# Altium schematic sheet S7CAS-PLEIADES-CARTE-MERE_P20_DDR3-decouplage.SchDoc
size Tabloid; Sheet_Name: DDR3 Decoupling; Size: 11x17
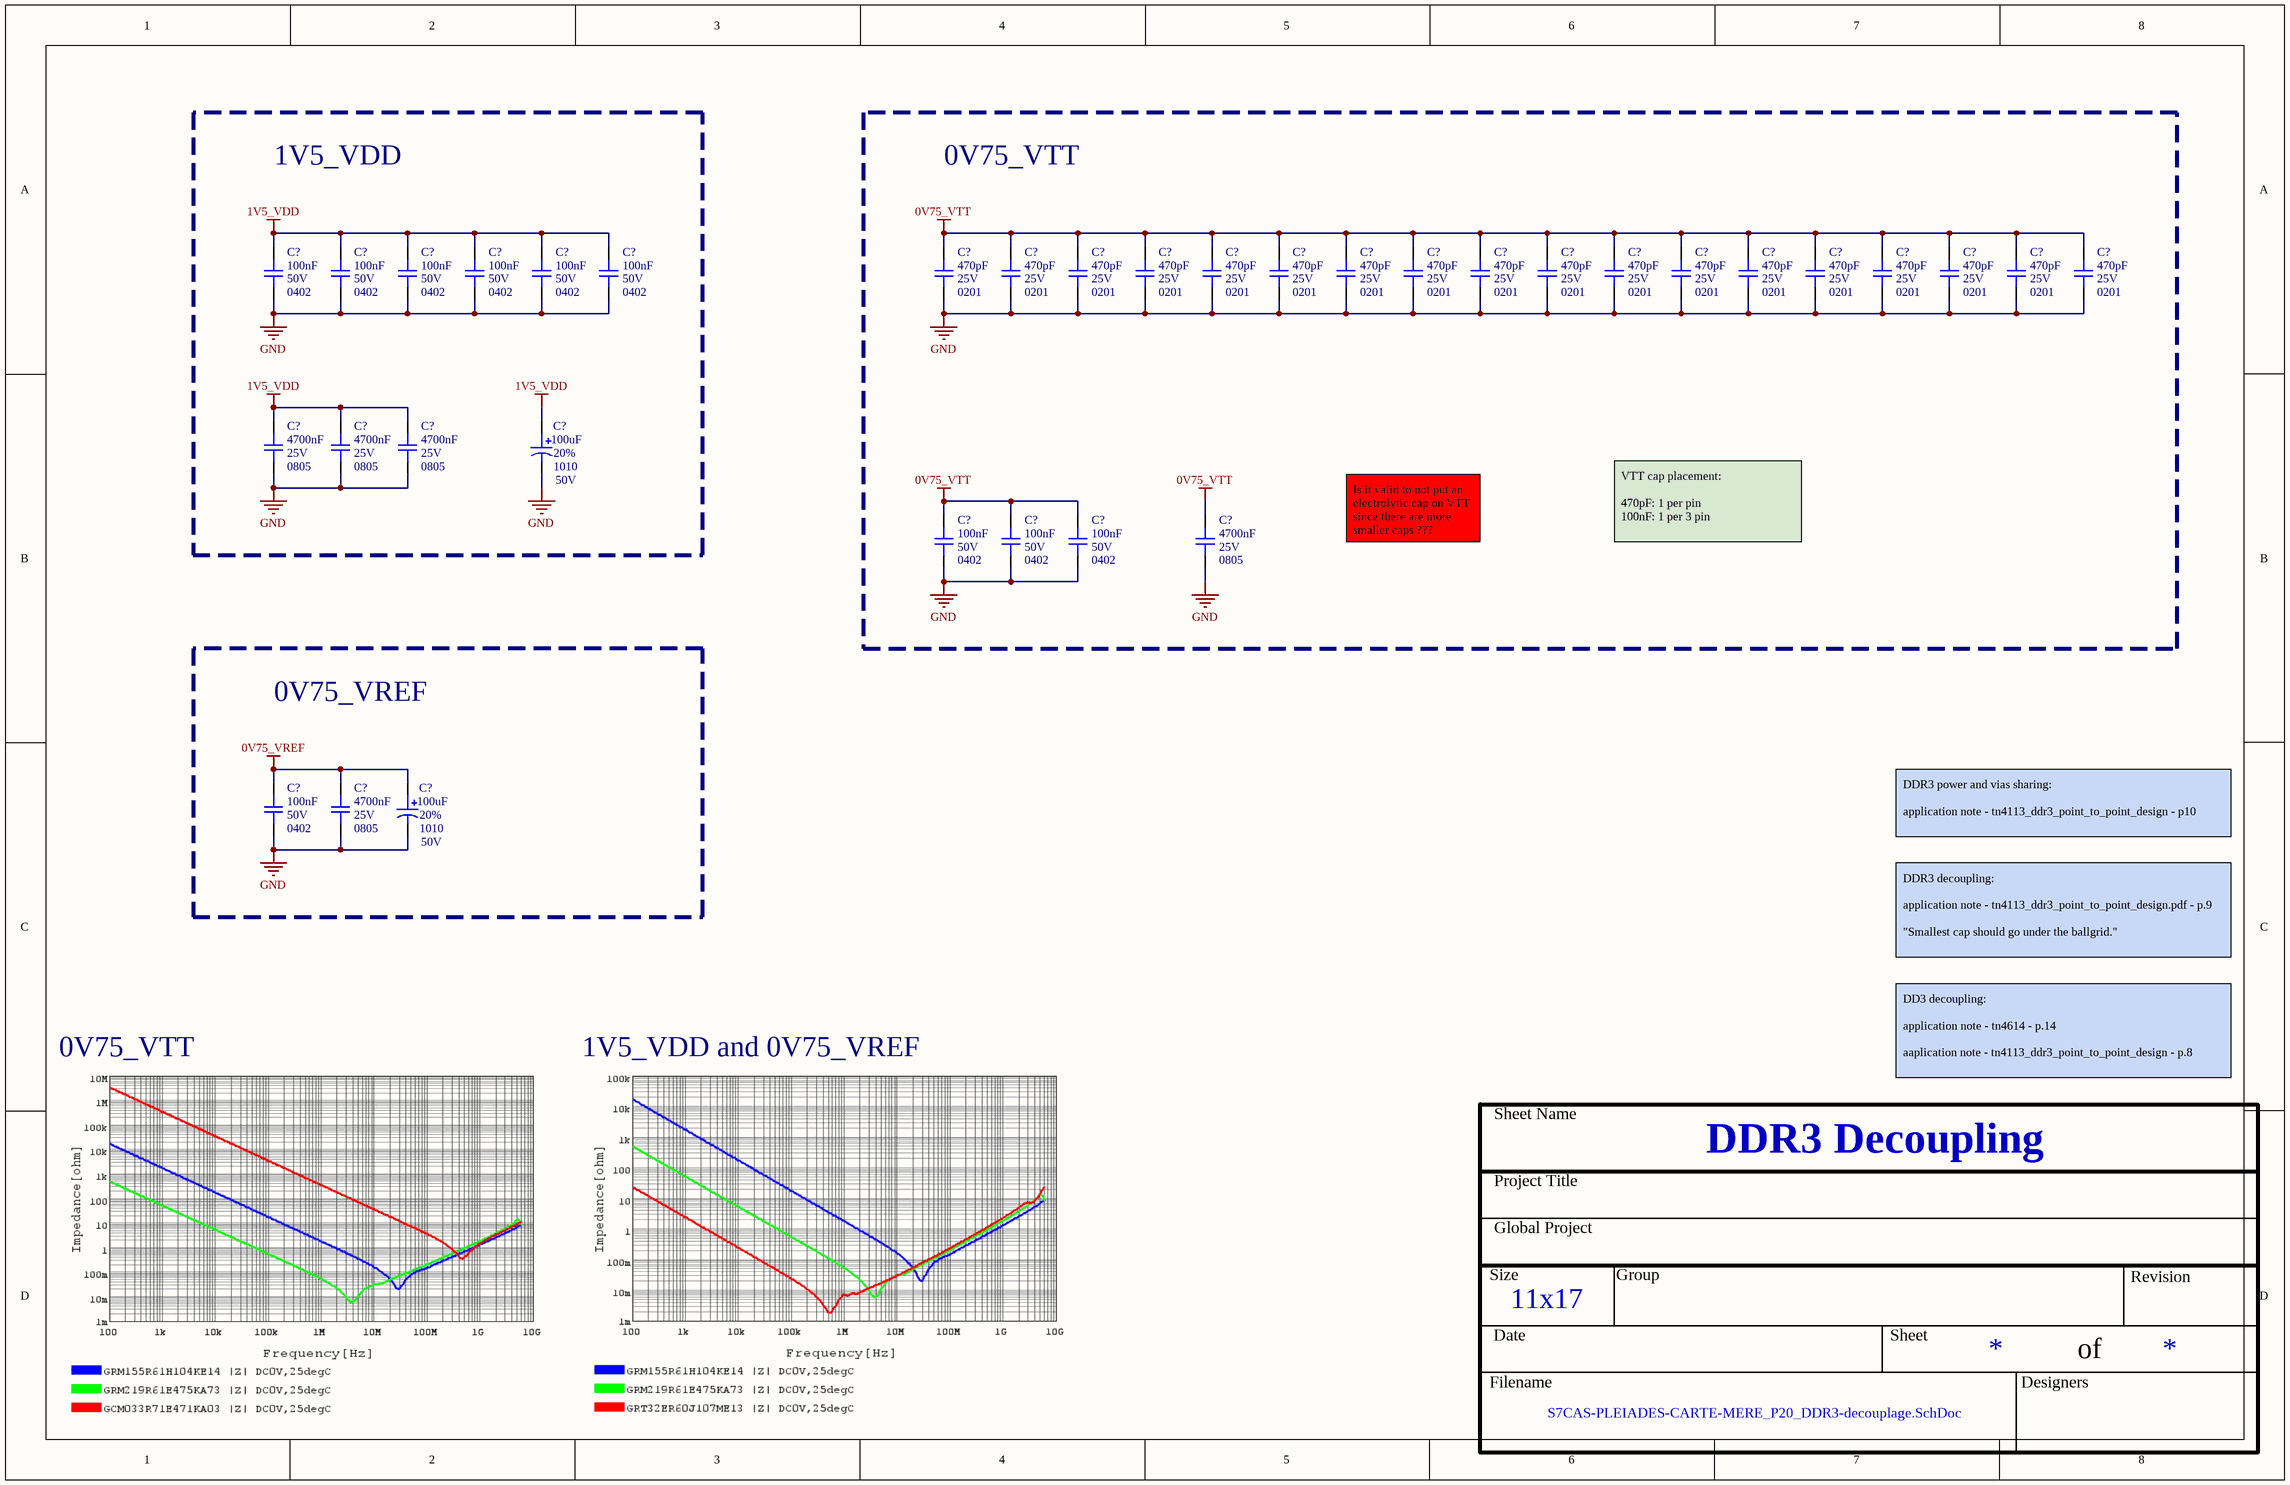
[diagram p0: S7CAS-PLEIADES-CARTE-MERE_P20_DDR3-decouplage.SchDoc]

## Parts
(Parts that share a designator on the sheet are numbered #1, #2 ... from top to bottom, then left to right.)
C?#1  value 100nF  Voltage: 50V  Package: 0402  [CAP_0201]  (hidden comment: CAP - 0201)
C?#2  value 100nF  Voltage: 50V  Package: 0402  [CAP_0201]  (hidden comment: CAP - 0201)
C?#3  value 100nF  Voltage: 50V  Package: 0402  [CAP_0201]  (hidden comment: CAP - 0201)
C?#4  value 100nF  Voltage: 50V  Package: 0402  [CAP_0201]  (hidden comment: CAP - 0201)
C?#5  value 100nF  Voltage: 50V  Package: 0402  [CAP_0201]  (hidden comment: CAP - 0201)
C?#6  value 100nF  Voltage: 50V  Package: 0402  [CAP_0201]  (hidden comment: CAP - 0201)
C?#7  value 470pF  Voltage: 25V  Package: 0201  [CAP_0201]  (hidden comment: CAP - 0201)
C?#8  value 470pF  Voltage: 25V  Package: 0201  [CAP_0201]  (hidden comment: CAP - 0201)
C?#9  value 470pF  Voltage: 25V  Package: 0201  [CAP_0201]  (hidden comment: CAP - 0201)
C?#10  value 470pF  Voltage: 25V  Package: 0201  [CAP_0201]  (hidden comment: CAP - 0201)
C?#11  value 470pF  Voltage: 25V  Package: 0201  [CAP_0201]  (hidden comment: CAP - 0201)
C?#12  value 470pF  Voltage: 25V  Package: 0201  [CAP_0201]  (hidden comment: CAP - 0201)
C?#13  value 470pF  Voltage: 25V  Package: 0201  [CAP_0201]  (hidden comment: CAP - 0201)
C?#14  value 470pF  Voltage: 25V  Package: 0201  [CAP_0201]  (hidden comment: CAP - 0201)
C?#15  value 470pF  Voltage: 25V  Package: 0201  [CAP_0201]  (hidden comment: CAP - 0201)
C?#16  value 470pF  Voltage: 25V  Package: 0201  [CAP_0201]  (hidden comment: CAP - 0201)
C?#17  value 470pF  Voltage: 25V  Package: 0201  [CAP_0201]  (hidden comment: CAP - 0201)
C?#18  value 470pF  Voltage: 25V  Package: 0201  [CAP_0201]  (hidden comment: CAP - 0201)
C?#19  value 470pF  Voltage: 25V  Package: 0201  [CAP_0201]  (hidden comment: CAP - 0201)
C?#20  value 470pF  Voltage: 25V  Package: 0201  [CAP_0201]  (hidden comment: CAP - 0201)
C?#21  value 470pF  Voltage: 25V  Package: 0201  [CAP_0201]  (hidden comment: CAP - 0201)
C?#22  value 470pF  Voltage: 25V  Package: 0201  [CAP_0201]  (hidden comment: CAP - 0201)
C?#23  value 470pF  Voltage: 25V  Package: 0201  [CAP_0201]  (hidden comment: CAP - 0201)
C?#24  value 470pF  Voltage: 25V  Package: 0201  [CAP_0201]  (hidden comment: CAP - 0201)
C?#25  value 4700nF  Voltage: 25V  Package: 0805  [CAP_0402]  (hidden comment: CAP - 0402)
C?#26  value 4700nF  Voltage: 25V  Package: 0805  [CAP_0402]  (hidden comment: CAP - 0402)
C?#27  value 4700nF  Voltage: 25V  Package: 0805  [CAP_0402]  (hidden comment: CAP - 0402)
C?#28  value 100uF  Voltage: 50V  Package: 1010  Precision: 20%  [CAP_ALU_1010_vishay]  (hidden comment: MAL215099101E3)
C?#29  value 100nF  Voltage: 50V  Package: 0402  [CAP_0201]  (hidden comment: CAP - 0201)
C?#30  value 100nF  Voltage: 50V  Package: 0402  [CAP_0201]  (hidden comment: CAP - 0201)
C?#31  value 100nF  Voltage: 50V  Package: 0402  [CAP_0201]  (hidden comment: CAP - 0201)
C?#32  value 4700nF  Voltage: 25V  Package: 0805  [CAP_0402]  (hidden comment: CAP - 0402)
C?#33  value 100nF  Voltage: 50V  Package: 0402  [CAP_0201]  (hidden comment: CAP - 0201)
C?#34  value 4700nF  Voltage: 25V  Package: 0805  [CAP_0402]  (hidden comment: CAP - 0402)
C?#35  value 100uF  Voltage: 50V  Package: 1010  Precision: 20%  [CAP_ALU_1010_vishay]  (hidden comment: MAL215099101E3)

## Blocks framed on the sheet
1V5_VDD: C?#1-C?#6 C?#25-C?#28
0V75_VTT: C?#7-C?#24 C?#29-C?#32
0V75_VREF: C?#33-C?#35

## Nets
0V75_VREF: C?#33.2 C?#34.2 C?#35.1
0V75_VTT: C?#7.2 C?#8.2 C?#9.2 C?#10.2 C?#11.2 C?#12.2 C?#13.2 C?#14.2 C?#15.2 C?#16.2 C?#17.2 C?#18.2 C?#19.2 C?#20.2 C?#21.2 C?#22.2 C?#23.2 C?#24.2 C?#29.2 C?#30.2 C?#31.2 C?#32.2
1V5_VDD: C?#1.2 C?#2.2 C?#3.2 C?#4.2 C?#5.2 C?#6.2 C?#25.2 C?#26.2 C?#27.2 C?#28.1
GND: C?#1.1 C?#2.1 C?#3.1 C?#4.1 C?#5.1 C?#6.1 C?#7.1 C?#8.1 C?#9.1 C?#10.1 C?#11.1 C?#12.1 C?#13.1 C?#14.1 C?#15.1 C?#16.1 C?#17.1 C?#18.1 C?#19.1 C?#20.1 C?#21.1 C?#22.1 C?#23.1 C?#24.1 C?#25.1 C?#26.1 C?#27.1 C?#28.2 C?#29.1 C?#30.1 C?#31.1 C?#32.1 C?#33.1 C?#34.1 C?#35.2

## Notes on the sheet
- Is it valid to not put an electrolytic cap on VTT since there are more smaller caps ???
- VTT cap placement:
  470pF: 1 per pin
  100nF: 1 per 3 pin
- DDR3 power and vias sharing:
  application note - tn4113_ddr3_point_to_point_design - p10
- DDR3 decoupling:
  application note - tn4113_ddr3_point_to_point_design.pdf - p.9
  "Smallest cap should go under the ballgrid."
- 0V75_VTT
- 1V5_VDD and 0V75_VREF
- DD3 decoupling:
  application note - tn4614 - p.14
  aaplication note - tn4113_ddr3_point_to_point_design - p.8
- Sheet Name
- Project Title
- Global Project
- Size
- Group
- Revision
- Date
- Sheet
- of
- Filename
- Designers

## Library data of the parts
C?#1-C?#6 C?#29-C?#31 C?#33 = CAP - 0201: Mfg Part Number: GRM155R61H104KE14; Precision: 10%; Current: *; CreatedBy: Jonathan Bouchard; Power: *
C?#7-C?#24 = CAP - 0201: Mfg Part Number: GCM033R71E471KA03; Precision: 10%; Current: *; CreatedBy: Jonathan Bouchard; Power: *
C?#25-C?#27 C?#32 C?#34 = CAP - 0402: Mfg Part Number: GRM219R61E475KA73; Precision: 10%; Current: *; CreatedBy: Jonathan Bouchard; Power: *
C?#28 C?#35 = CAP_ALU_MAL215099101E3: CAP - ALU 100uF 20% 50V - 1010; Current: 490mA; Mfg: Vishay Dale; Mfg Part Number: MAL215099101E3; HelpURL: http://www.vishay.com/docs/28395/150crz.pdf; CreatedBy: Jonathan Bouchard; Temperature: -55°C to 125°C; Power: *; Supplier 1: Digikey; Supplier Part Number 1: 4399PHDKR-ND